# EAGLE design 18650 Capacity (EAGLE 7.5.0)
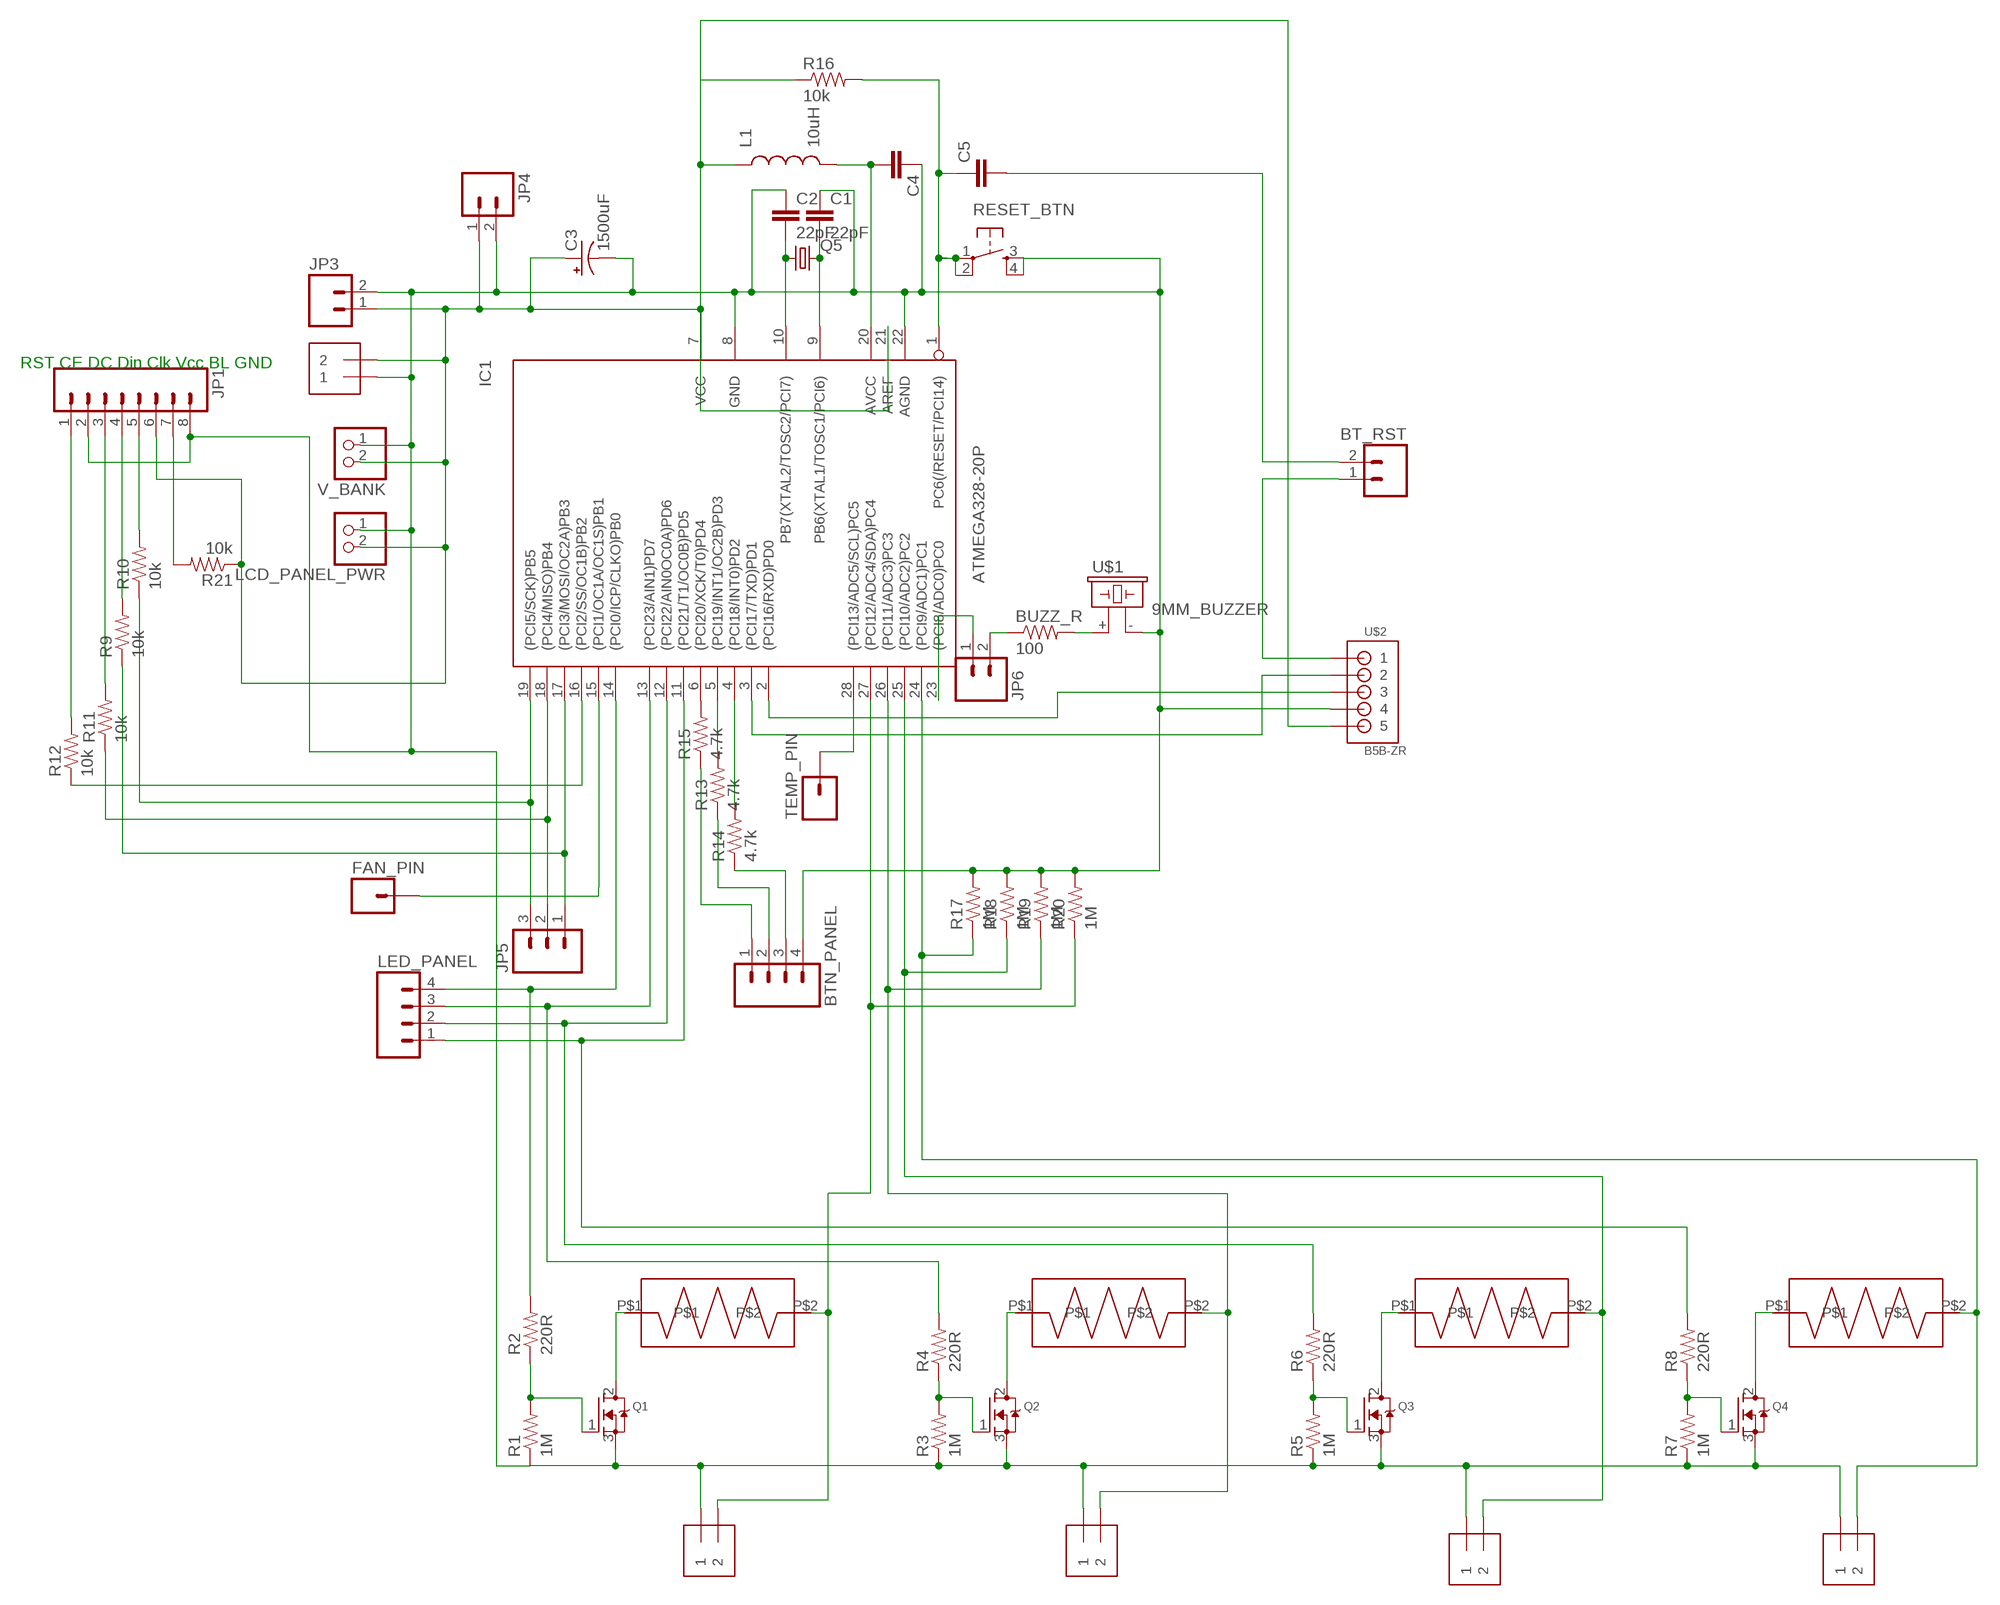
[diagram p0: schematic, sheet 1]

## Parts
5V_VIN  1X2-3.5MM  [1X2-3.5MM]
BATT1  1X2-3.5MM  [1X2-3.5MM]
BATT2  1X2-3.5MM  [1X2-3.5MM]
BATT3  1X2-3.5MM  [1X2-3.5MM]
BATT4  1X2-3.5MM  [1X2-3.5MM]
BT_RST  M02LOCK  [1X02_LOCK]
BTN_PANEL  M04LOCK  [1X04_LOCK]
BUZZ_R  100  RESISTOR1206  [1206]
C1  22pF  CAPEZ  [CAP-PTH-SMALLEZ]
C2  22pF  CAPEZ  [CAP-PTH-SMALLEZ]
C3  1500uF  CAP_POLPTH1  [CPOL-RADIAL-100UF-25V]
C4  CAPPTH1  [CAP-PTH-5MM]
C5  CAP_  [AXIAL-5MM]
FAN_PIN  M01PTH  [1X01]
IC1  ATMEGA328-20P  [DIL28-3]
JP1  M08LOCK  [1X08_LOCK]
JP3  M02LOCK  [1X02_LOCK]
JP4  M02LOCK  [1X02_LOCK]
JP5  M03PTH  [1X03]
JP6  M02LOCK  [1X02_LOCK]
L1  10uH  INDUCTORRLB0912  [RLB0912]
LCD_PANEL_PWR  JST_2PIN-THM  [JST-PH-2-THM]
LED_PANEL  M04LOCK  [1X04_LOCK]
LOAD4  CEMENT_RESISTOR  [CEMENT_RESISTOR]
LOAD_1  CEMENT_RESISTOR  [CEMENT_RESISTOR]
LOAD_2  CEMENT_RESISTOR  [CEMENT_RESISTOR]
Q1  MOSFET-NGDS_TO220V  [TO220V]
Q2  MOSFET-NGDS_TO220V  [TO220V]
Q3  MOSFET-NGDS_TO220V  [TO220V]
Q4  MOSFET-NGDS_TO220V  [TO220V]
Q5  CRYTALHC49S  [HC49/S]
R1  1M  RESISTORAXIAL-0.3  [AXIAL-0.3]
R2  220R  RESISTORAXIAL-0.3  [AXIAL-0.3]
R3  1M  RESISTORAXIAL-0.3  [AXIAL-0.3]
R4  220R  RESISTORAXIAL-0.3  [AXIAL-0.3]
R5  1M  RESISTORAXIAL-0.3  [AXIAL-0.3]
R6  220R  RESISTORAXIAL-0.3  [AXIAL-0.3]
R7  1M  RESISTORAXIAL-0.3  [AXIAL-0.3]
R8  220R  RESISTORAXIAL-0.3  [AXIAL-0.3]
R9  10k  RESISTORAXIAL-0.3  [AXIAL-0.3]
R10  10k  RESISTORAXIAL-0.3  [AXIAL-0.3]
R11  10k  RESISTORAXIAL-0.3  [AXIAL-0.3]
R12  10k  RESISTORAXIAL-0.3  [AXIAL-0.3]
R13  4.7k  RESISTORAXIAL-0.3  [AXIAL-0.3]
R14  4.7k  RESISTORAXIAL-0.3  [AXIAL-0.3]
R15  4.7k  RESISTORAXIAL-0.3  [AXIAL-0.3]
R16  10k  RESISTORAXIAL-0.3  [AXIAL-0.3]
R17  1M  RESISTOR0805-RES  [0805]
R18  1M  RESISTOR0805-RES  [0805]
R19  1M  RESISTOR0805-RES  [0805]
R20  1M  RESISTOR0805-RES  [0805]
R21  10k  RESISTOR1206  [1206]
RESET_BTN  TAC_SWITCHPTH  [TACTILE-PTH]
TEMP_PIN  M01PTH  [1X01]
U$1  9MM_BUZZER  [AL11P]
U$2  B5B-ZR  [B5B-ZR]
U$3  CEMENT_RESISTOR  [CEMENT_RESISTOR]
V_BANK  JST_2PIN-THM  [JST-PH-2-THM]

## Nets
BATT_V1: BATT1.2 IC1.27((PCI12/ADC4/SDA)PC4) LOAD_1.P$2 R20.1
BATT_V2: BATT2.2 IC1.26((PCI11/ADC3)PC3) LOAD_2.P$2 R19.1
BATT_V3: BATT3.2 IC1.25((PCI10/ADC2)PC2) R18.1 U$3.P$2
BATT_V4: BATT4.2 IC1.24((PCI9/ADC1)PC1) LOAD4.P$2 R17.1
BT_RX: IC1.3((PCI17/TXD)PD1) U$2.2
BT_STATE: BT_RST.2 C5.P$2
BT_TX: IC1.2((PCI16/RXD)PD0) U$2.3
CLK: JP1.5 R10.P$2
CLK1: IC1.19((PCI5/SCK)PB5) JP5.3 R10.P$1
DC: JP1.3 R11.P$2
DC1: IC1.18((PCI4/MISO)PB4) JP5.2 R11.P$1
DIN: JP1.4 R9.P$2
DIN1: IC1.17((PCI3/MOSI/OC2A)PB3) JP5.1 R9.P$1
GATE1: IC1.14((PCI0/ICP/CLKO)PB0) LED_PANEL.4 R2.P$2
GATE2: IC1.13((PCI23/AIN1)PD7) LED_PANEL.3 R4.P$2
GATE3: IC1.12((PCI22/AIN0OC0A)PD6) LED_PANEL.2 R6.P$2
GATE4: IC1.11((PCI21/T1/OC0B)PD5) LED_PANEL.1 R8.P$2
GND: 5V_VIN.1 BATT1.1 BATT2.1 BATT3.1 BATT4.1 BTN_PANEL.4 C1.1 C2.1 C3.2(-) C4.1 IC1.8(GND) IC1.22(AGND) JP1.2 JP1.8 JP3.2 JP4.2 LCD_PANEL_PWR.1 Q1.3(S) Q2.3(S) Q3.3(S) Q4.3(S) R1.P$1 R3.P$1 R5.P$1 R7.P$1 R17.2 R18.2 R19.2 R20.2 RESET_BTN.3 RESET_BTN.4 U$1.- U$2.4 V_BANK.1
N$1: C2.2 IC1.10(PB7(XTAL2/TOSC2/PCI7)) Q5.1
N$3: LOAD4.P$1 Q4.2(D)
N$4: BUZZ_R.1 JP6.2
N$5: IC1.4((PCI18/INT0)PD2) R14.P$2
N$6: Q1.1(G) R1.P$2 R2.P$1
N$7: Q2.1(G) R3.P$2 R4.P$1
N$8: Q3.1(G) R5.P$2 R6.P$1
N$9: Q4.1(G) R7.P$2 R8.P$1
N$10: C1.2 IC1.9(PB6(XTAL1/TOSC1/PCI6)) Q5.2
N$11: C5.P$1 IC1.1(PC6(/RESET/PCI14)) R16.P$2 RESET_BTN.1 RESET_BTN.2
N$12: IC1.5((PCI19/INT1/OC2B)PD3) R13.P$2
N$13: IC1.23((PCI8/ADC0)PC0) JP6.1
N$14: C4.2 IC1.20(AVCC) L1.2
N$16: IC1.6((PCI20/XCK/T0)PD4) R15.P$2
N$17: BTN_PANEL.2 R13.P$1
N$18: LOAD_1.P$1 Q1.2(D)
N$19: LOAD_2.P$1 Q2.2(D)
N$20: Q3.2(D) U$3.P$1
N$21: BTN_PANEL.3 R14.P$1
N$22: BTN_PANEL.1 R15.P$1
N$23: BT_RST.1 U$2.1
N$24: BUZZ_R.2 U$1.+
N$25: IC1.28((PCI13/ADC5/SCL)PC5) TEMP_PIN.1
PMW_LED: JP1.7 R21.2
PWM_LED1: FAN_PIN.1 IC1.15((PCI1/OC1A/OC1S)PB1)
RST: JP1.1 R12.P$2
RST1: IC1.16((PCI2/SS/OC1B)PB2) R12.P$1
VCC: 5V_VIN.2 C3.1(+) IC1.7(VCC) IC1.21(AREF) JP1.6 JP3.1 JP4.1 L1.1 LCD_PANEL_PWR.2 R16.P$1 R21.1 U$2.5 V_BANK.2

## Notes on the sheet
- RST CE DC Din Clk Vcc BL GND

## Library data of the parts
5V_VIN BATT1-BATT4 = adafruit:1X2: 3.5mm Terminal block http://www.ladyada.net/library/pcb/eaglelibrary.html
BT_RST JP3 JP4 JP6 = SparkFun-Connectors:M02: Standard 2-pin 0.1" header. Use with - straight break away headers ( PRT-00116) - right angle break away headers (PRT-00553) - swiss pins (PRT-00743) - machine pins (PRT-00117) - female headers (PRT-00115) Molex polarized connector foot print use with: PRT-08233 with associated crimp pins and housings. 2.54_SCREWTERM for use with PRT-10571. 3.5mm Screw Terminal footprints for PRT-08084 5mm Screw Terminal footprints for use with PRT-08432
BTN_PANEL LED_PANEL = SparkFun-Connectors:M04: Header 4 Standard 4-pin 0.1" header. Use with straight break away headers (SKU : PRT-00116), right angle break away headers (PRT-00553), swiss pins (PRT-00743), machine pins (PRT-00117), and female headers (PRT-00115). Molex polarized connector foot print use with SKU : PRT-08231 with associated crimp pins and housings. 1MM SMD Version SKU: PRT-10208
BUZZ_R R9-R16 = SparkFun-Resistors:RESISTOR: Resistor Basic schematic elements and footprints for 0603, 1206, and PTH resistors.
C1 C2 C4 C5 = SparkFun-Passives:CAP: Capacitor Standard 0603 ceramic capacitor, and 0.1" leaded capacitor.
C3 = SparkFun-Passives:CAP_POL: Capacitor Polarized These are standard SMD and PTH capacitors. Normally 10uF, 47uF, and 100uF in electrolytic and tantalum varieties. Always verify the external diameter of the through hole cap, it varies with capacity, voltage, and manufacturer. The EIA devices should be standard.
FAN_PIN TEMP_PIN = SparkFun-Connectors:M01: Header 1 Standard 1-pin 0.1" header. Use with straight break away headers (SKU : PRT-00116), right angle break away headers (PRT-00553), swiss pins (PRT-00743), machine pins (PRT-00117), and female headers (PRT-00115).
IC1 = atmega328:ATMEGA328*P: MICROCONTROLLER 32 kBytes FLASH 2 kBytes SRAM 1 kBytes EEPROM USART 8-channel 10 bit ADC
JP1 = SparkFun-Connectors:M08: Header 8 Standard 8-pin 0.1" header. Use with straight break away headers (SKU : PRT-00116), right angle break away headers (PRT-00553), swiss pins (PRT-00743), machine pins (PRT-00117), and female headers (PRT-00115).
JP5 = SparkFun-Connectors:M03: Header 3 Standard 3-pin 0.1" header. Use with straight break away headers (SKU : PRT-00116), right angle break away headers (PRT-00553), swiss pins (PRT-00743), machine pins (PRT-00117), and female headers (PRT-00115). Molex polarized connector foot print use with SKU : PRT-08232 with associated crimp pins and housings.
L1 = SparkFun-Passives:INDUCTOR: Inductors Basic Inductor/Choke - 0603 and 1206. Footprints are not proven and vary greatly between part numbers. INDUCTOR POWER 3.3UH 4.0A SMD 0.197" L x 0.197" W x 0.177" H (5.00mm x 5.00mm x 4.50mm)
LCD_PANEL_PWR V_BANK = adafruit:JST_2PIN: JST 2-Pin Connectors of various flavors SMT-RA (S2B-PH-SM4) 4UConnector #17311 SMT (B2B-PH-SM4) THM-RA (S2B-PH) THM (B2B-PH)
LOAD4 LOAD_1 LOAD_2 U$3 = Jon_SelfMade:CEMENT_RESISTOR
Q1-Q4 = adafruit:MOSFET-N: N-Channel Mosfet 2N7002E - 60V 260mA SOT23 [Digikey: 2N7002ET1GOSTR-ND] - REEL BSH103 - 30V 850mA SOT23 [Digikey: 568-5013-1-ND]
Q5 = Crystals:CRYTAL: CRYSTAL
R1-R8 R17-R21 = SparkFun-Passives:RESISTOR: Resistor Basic schematic elements and footprints for 0603, 1206, and PTH resistors.
RESET_BTN = SparkFun-Retired:TAC_SWITCH: Momentary Switch Button commonly used for reset or general input. Spark Fun Electronics SKU : COM-00097 SMT- SWCH-08247
U$1 = Jon_SelfMade:9MM_BUZZER
U$2 = jst:B5B-ZR: JST-ZH Connector 5 pol, 1.5mm pitch Package: B5B-ZR Source: http://www.jst-mfg.com/product/pdf/eng/eZH.pdf

## Board
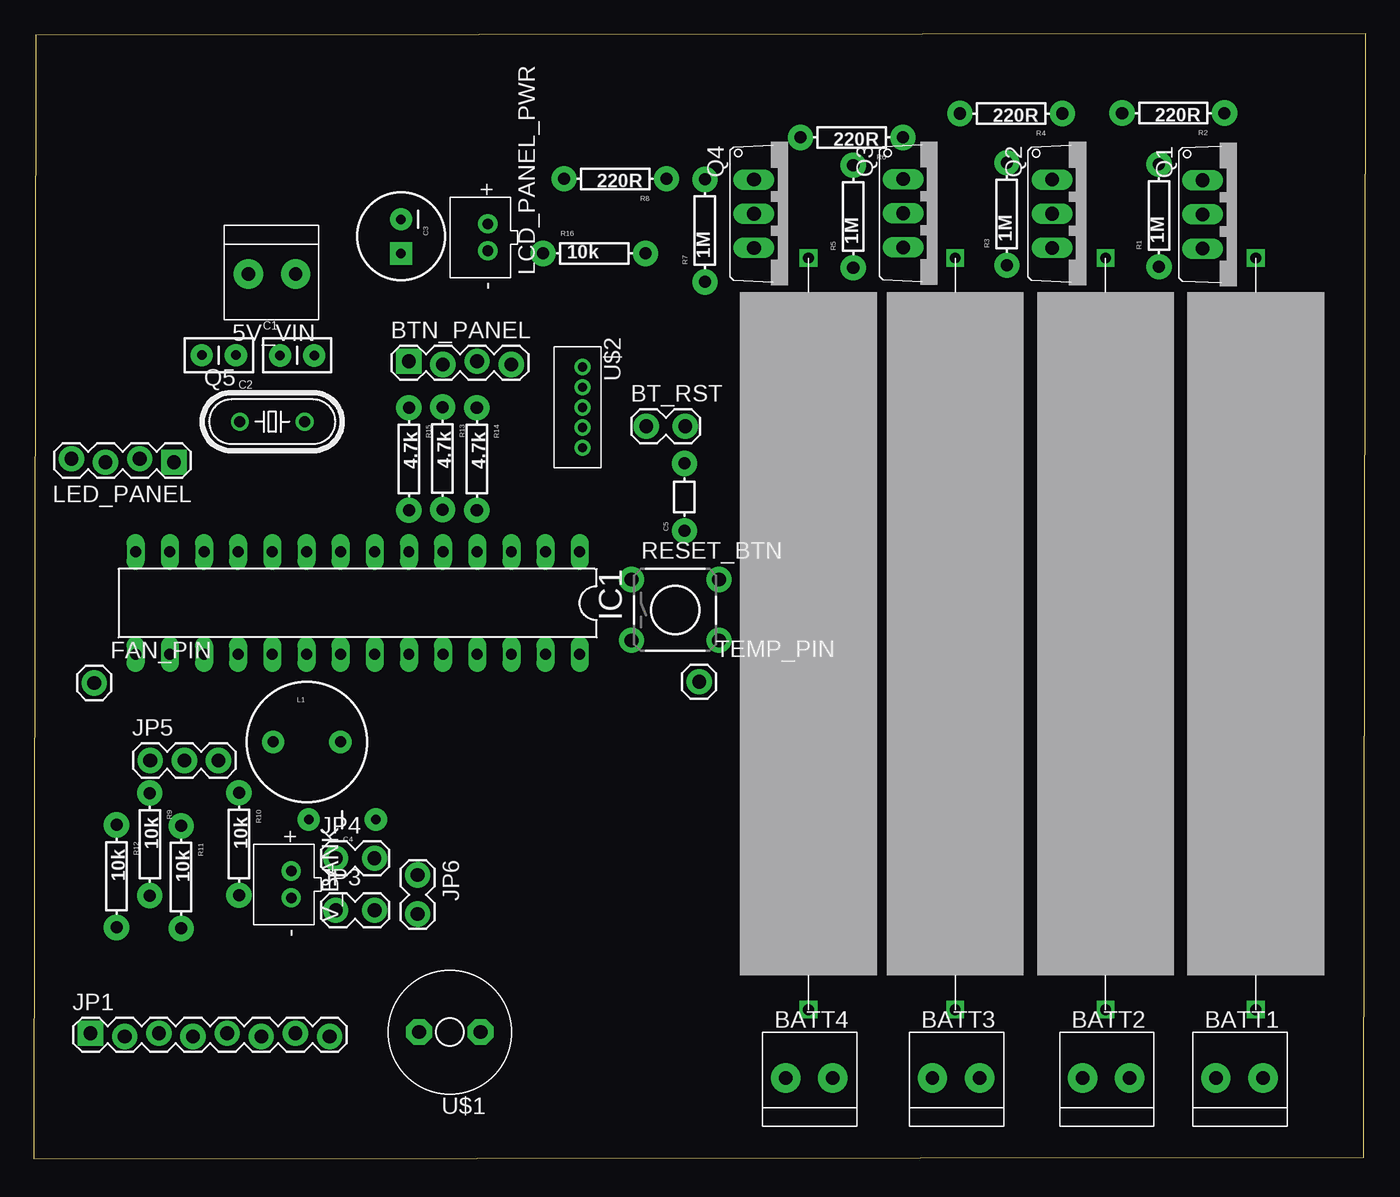
[diagram p1: board, top side]
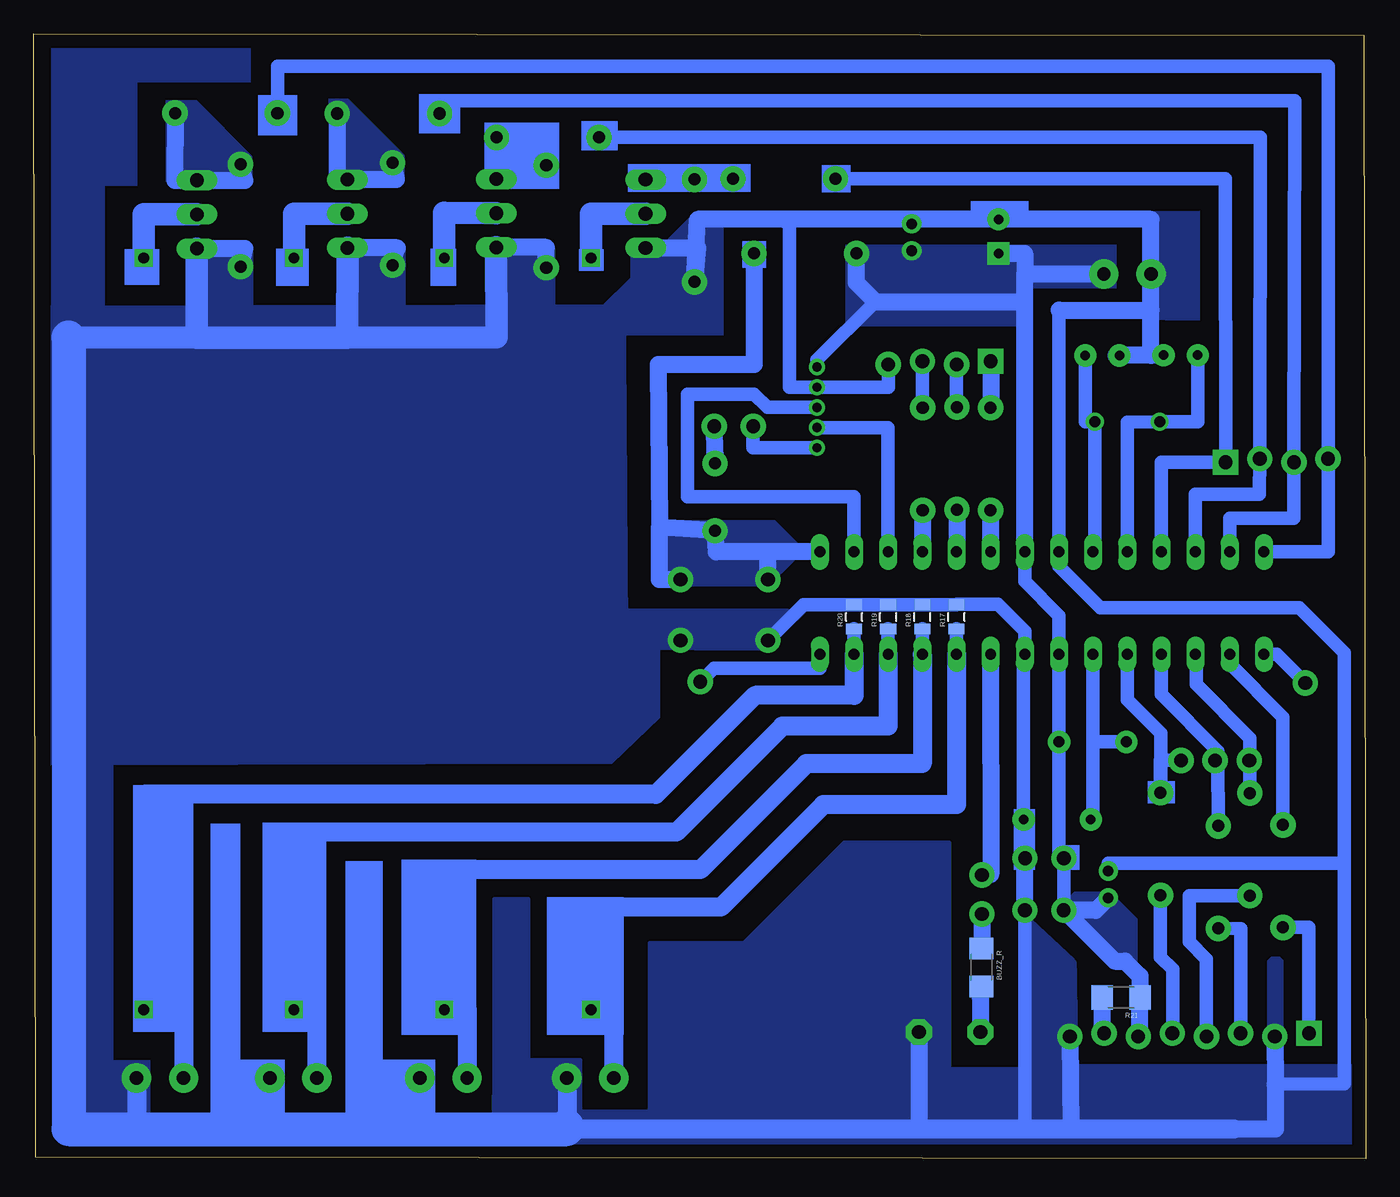
[diagram p2: board, bottom side, seen from below]

Size 99.09 x 83.66 mm. Coordinates in mm from the lower left corner, seen from the top.
Outline: 0,0 98.94,0.11 99.09,83.66 0.16,83.55 0,0
Copper layers (1*16): Top 0.035mm / dielectric 1.5mm / Bottom 0.035mm
Design rules "default": minimum track width 10mil, minimum drill 24mil, track to track 8mil, track to pad 8mil, pad to pad 8mil, via to via 8mil, smd to smd 8mil, copper to edge 40mil, drill to drill 8mil, minimum pad ring 10mil, minimum via ring 8mil, stop-mask expansion 4mil, vias tented up to drill 0mil, thermal gap 10mil

### Footprints (pad centres in the part's own frame; a part is rotated, then mirrored left to right if it is on the bottom)
1X2-3.5MM = drill 1 pad 2.184: 1 1.8,0; 2 -1.7,0
1X02_LOCK = drill 1.016 pad 1.88: 1 -0.178,0; 2 2.718,0
1X04_LOCK = drill 1.016 pad 1.88 square: 1 0,0.127 | drill 1.016 pad 1.88: 2 2.54,-0.127; 3 5.08,0.127; 4 7.62,-0.127
1206 = smd 1.6 x 1.8: 1 -1.4,0; 2 1.4,0
CAP-PTH-SMALLEZ = drill 0.7 pad 1.651: 1 0,0; 2 2.54,0
CPOL-RADIAL-100UF-25V = drill 0.7 pad 1.651 square: 1 1.27,0 | drill 0.7 pad 1.651: 2 -1.27,0
CAP-PTH-5MM = drill 0.7 pad 1.651: 1 -2.5,0; 2 2.5,0
AXIAL-5MM = drill 0.9 pad 1.88: P$1 -2.5,0; P$2 2.5,0
1X01 = drill 1.016 pad 1.88: 1 0,0
DIL28-3 = drill 0.813 long: 1 -16.51,-3.81; 2 -13.97,-3.81; 3 -11.43,-3.81; 4 -8.89,-3.81; 5 -6.35,-3.81; 6 -3.81,-3.81; 7 -1.27,-3.81; 8 1.27,-3.81; 9 3.81,-3.81; 10 6.35,-3.81; 11 8.89,-3.81; 12 11.43,-3.81; 13 13.97,-3.81; 14 16.51,-3.81; 15 16.51,3.81; 16 13.97,3.81; 17 11.43,3.81; 18 8.89,3.81; 19 6.35,3.81; 20 3.81,3.81; 21 1.27,3.81; 22 -1.27,3.81; 23 -3.81,3.81; 24 -6.35,3.81; 25 -8.89,3.81; 26 -11.43,3.81; 27 -13.97,3.81; 28 -16.51,3.81
1X08_LOCK = drill 1.016 pad 1.88 square: 1 0,0.127 | drill 1.016 pad 1.88: 2 2.54,-0.127; 3 5.08,0.127; 4 7.62,-0.127; 5 10.16,0.127; 6 12.7,-0.127; 7 15.24,0.127; 8 17.78,-0.127
1X03 = drill 1.016 pad 1.88: 1 0,0; 2 2.54,0; 3 5.08,0
RLB0912 = drill 0.813 pad 1.651: 1 2.502,0; 2 -2.502,0
JST-PH-2-THM = drill 0.8 pad 1.422: 1 1,0; 2 -1,0
CEMENT_RESISTOR = drill 0.8 square: P$1 -27.94,0; P$2 27.94,0
TO220V = drill 1.016 long: 1 -2.54,-2.54; 2 0,-2.54; 3 2.54,-2.54
HC49/S = drill 0.813: 1 -2.413,0; 2 2.413,0
AXIAL-0.3 = drill 0.9 pad 1.88: P$1 -3.81,0; P$2 3.81,0
0805 = smd 0.8 x 1.2: 1 -0.9,0; 2 0.9,0
TACTILE-PTH = drill 1.016 pad 1.88: 1 -3.251,2.261; 2 3.251,2.261; 3 -3.251,-2.261; 4 3.251,-2.261
AL11P = drill 1.016 pad 1.905 octagon: + 2.286,0; - -2.286,0
B5B-ZR = drill 0.7: 1 7.5,-1.3; 2 6,-1.3; 3 4.5,-1.3; 4 3,-1.3; 5 1.5,-1.3

### Placement (x,y rotation side)
5V_VIN  17.79,65.8 180 top
BATT1  89.63,6.01 0 top
BATT2  79.73,6.01 0 top
BATT3  68.55,6.01 0 top
BATT4  57.63,6.01 0 top
BT_RST  45.75,54.47 0 top
BTN_PANEL  27.91,59.18 0 top
BUZZ_R  28.6,14.23 270 bottom
C1  18.33,59.74 0 top
C2  15.05,59.76 180 top
C3  27.32,68.58 270 top
C4  22.96,25.22 180 top
C5  48.41,49.21 90 top
FAN_PIN  4.51,35.38 0 top
IC1  24.1,41.32 180 top
JP1  4.23,9.21 0 top
JP3  22.65,18.48 0 top
JP4  22.64,22.35 0 top
JP5  8.67,29.62 0 top
JP6  28.56,20.92 270 top
L1  20.32,31 0 top
LCD_PANEL_PWR  33.79,68.51 90 top
LED_PANEL  10.43,51.92 180 top
LOAD4  57.63,39.03 270 top
LOAD_1  90.9,39.03 270 top
LOAD_2  79.73,39.03 270 top
Q1  89.5,70.22 270 top
Q2  78.29,70.27 270 top
Q3  67.22,70.31 270 top
Q4  56.12,70.27 270 top
Q5  17.75,54.81 0 top
R1  83.7,70.13 90 top
R2  84.77,77.76 180 top
R3  72.39,70.25 90 top
R4  72.71,77.72 180 top
R5  60.96,70.06 90 top
R6  60.85,75.95 180 top
R7  49.94,69.01 90 top
R8  43.26,72.86 180 top
R9  8.64,23.38 270 top
R10  15.28,23.4 270 top
R11  10.97,20.94 270 top
R12  6.17,21.02 270 top
R13  30.41,52.08 270 top
R14  32.97,52.03 270 top
R15  27.92,52.04 270 top
R16  41.71,67.32 0 top
R17  30.45,40.3 90 bottom
R18  32.99,40.3 90 bottom
R19  35.53,40.3 90 bottom
R20  38.07,40.3 90 bottom
R21  18.21,12 180 bottom
RESET_BTN  47.72,40.81 0 top
TEMP_PIN  49.5,35.48 0 top
U$1  30.96,9.42 180 top
U$2  42.13,60.37 270 top
U$3  68.55,39.03 270 top
V_BANK  19.17,20.4 90 top

### Tracks (layer width: path | path; a pad name or v marks a point on that pad's centre or on a via)
BATT_V1
  Bottom 1.016: R20.1 IC1.27
  Bottom 1.422: BATT1.2 87.93,11.09 LOAD_1.P$2 90.9,27.09 52.8,27.09 45.44,34.46 38.07,34.46 IC1.27
BATT_V2
  Bottom 1.016: R19.1 IC1.26
  Bottom 1.422: BATT2.2 78.03,11.09 LOAD_2.P$2 79.73,24.3 51.28,24.3 43.41,32.17 35.53,32.17 IC1.26
BATT_V3
  Bottom 1.016: R18.1 IC1.25
  Bottom 1.422: BATT3.2 66.85,11.09 U$3.P$2 68.55,21.51 49.5,21.51 41.63,29.38 32.99,29.38 IC1.25
BATT_V4
  Bottom 1.016: R17.1 IC1.24
  Bottom 1.422: BATT4.2 55.93,11.09 LOAD4.P$2 57.63,18.71 47.98,18.71 40.36,26.33 30.45,26.33 IC1.24
BT_RX
  Bottom 1.016: U$2.2 35.53,54.37 IC1.3
BT_STATE
  Bottom 1.27: C5.P$2 48.4,52.42 BT_RST.2
BT_TX
  Bottom 1.016: U$2.3 44.51,55.87 45.5,56.86 50.45,56.86 50.45,49.22 38.07,49.22 IC1.2
CLK
  Bottom 1.016: R10.P$2 15.29,15 14.38,14.09 14.37,9.37 JP1.5
CLK1
  Bottom 1.016: IC1.19 17.75,34.12 15.27,31.63 15.27,27.22 R10.P$1 15.28,29.62 JP5.3
DC
  Bottom 1.016: R11.P$2 9.31,17.12 JP1.3
DC1
  Bottom 0.61: JP5.2 11.16,29.62 11,29.78
  Bottom 1.016: R11.P$1 11,29.78 11,30.31 15.22,34.53 IC1.18
DIN
  Bottom 1.016: R9.P$2 13.13,19.55 13.12,16.12 11.85,14.86 JP1.4
DIN1
  Bottom 0.61: JP5.1 8.67,30.7 8.62,30.74
  Bottom 1.016: R9.P$1 8.62,30.74 8.62,31.29 12.62,35.28 12.62,37.45 IC1.17
GATE1
  Bottom 1.016: IC1.14 2.8,45.13 LED_PANEL.4 2.81,81.22 80.96,81.22 R2.P$2
GATE2
  Bottom 1.016: IC1.13 10.13,47.62 5.35,47.62 LED_PANEL.3 5.3,78.67 68.9,78.67 R4.P$2
GATE3
  Bottom 1.016: IC1.12 12.67,49.41 7.94,49.4 LED_PANEL.2 7.87,75.94 52.92,75.94 R6.P$2
GATE4
  Bottom 1.016: IC1.11 15.22,51.79 LED_PANEL.1 10.44,72.88 R8.P$2
GND
  Bottom 1.016: 25.37,25.17 25.37,2.2 27.67,2.2 | BTN_PANEL.4 arc-90 BTN_PANEL.4 35.53,57.37 U$2.4 42.87,57.37 42.87,69.71 | RESET_BTN.3 41.82,41.2 R20.2 R19.2 R18.2 R17.2 30.43,41.22 27.37,41.22 25.37,39.23 IC1.22 25.46,37.42 C4.1 25.36,25.12 JP4.2 | 22.83,44.08 19.74,40.98 4.95,40.98 1.6,37.63 1.6,21.97 | 6.75,5.54 1.6,5.57 1.6,21.97 | IC1.8 22.83,63.1 | V_BANK.1 19.17,21.97 1.6,21.97 | LCD_PANEL_PWR.1 33.45,69.85 C3.2
  Bottom 1.27: U$1.- 33.25,2.2 | JP1.8 21.96,2.2 | JP1.2 6.75,5.54 6.72,2.2 9.82,2.2 | 15.99,59.74 18.58,59.74 C1.1 | C2.1 15.99,59.74 | 15.99,59.74 15.99,63.1 | 15.99,63.1 5V_VIN.1 15.99,69.85 C3.2 43.31,69.85 | 43.31,69.85 49.7,69.85 R7.P$1 49.7,67.73 Q4.3 | 22.83,63.1 15.99,63.1 | R5.P$1 60.96,67.77 Q3.3 | R3.P$1 72.05,67.73 Q2.3 | R1.P$1 83.38,67.68 Q1.3 | 42.87,69.71 43.31,69.85 | JP3.2 JP4.2
  Bottom 1.422: BATT3.1 70.35,2.2 | BATT1.1 91.43,2.2 | BATT2.1 81.53,2.2 | BATT4.1 59.43,2.46 | 9.82,2.2 21.96,2.2 27.67,2.2 33.25,2.2 59.43,2.2
  Bottom 1.676: Q1.3 86.95,61.05 | 86.95,61.05 96.49,61.07 | Q2.3 75.76,61.06 | 75.76,61.06 86.95,61.05 | Q3.3 64.66,61.07 75.76,61.06
  Bottom 2.54: 96.49,61.07 96.49,2.2 91.43,2.2 81.53,2.2 70.35,2.2 59.43,2.2 59.43,2.46
  pour Bottom (no thermals): 30.96,23.54 30.97,6.71 25.62,6.71 25.67,2.31 64.87,2.18 64.85,7.38 64.85,19.33 62.27,19.33 62.27,7.38 58.42,7.38 58.42,3.53 53.3,3.56 53.27,16.08 46.3,16.07 38.83,23.54
  pour Bottom: 97.82,29.28 56.07,29.38 52.52,32.81 52.52,38.34 54.89,38.33 54.89,39.11 55.04,60.18 55.04,61.25 52.7,63.55 97.81,63.44
  pour Bottom (no thermals): 93.72,30.03 95.82,30.03 95.82,1.88 90.42,1.88 90.42,7.33 93.17,7.33 93.17,29.73
  pour Bottom (no thermals): 42.97,40.88 55.22,40.88 55.29,37.86 44.57,37.78 41.57,40.72
  pour Bottom (no thermals): 22.02,14.5 25.22,17.48 25.22,2.43 22.07,2.43 22.07,5.03 21.92,5.98 21.97,13.78
  pour Bottom (no thermals): 6.12,5.03 6.14,14.78 6.39,15.03 7.04,15.03 7.34,14.73 7.32,4.08 7.02,4.08
  pour Bottom: 0.87,7.03 25.32,7.03 25.32,2.93 59.77,2.93 59.77,1.05 0.87,1.08
  pour Bottom (no thermals): 54.7,63.37 54.7,68.16 49.46,68.16 49.46,66.5 53.09,62.87
  pour Bottom (no thermals): 64.59,63.18 64.59,67.74 60.33,67.74 60.33,62.98 61.43,62.98
  pour Bottom (no thermals): 75.51,62.75 75.51,67.58 71.42,67.58 71.42,63.12 72.49,63.12
  pour Bottom (no thermals): 86.9,63 86.9,67.46 82.75,67.46 82.75,62.51 85.01,62.51
  pour Bottom (no thermals): 47.79,69.29 47.79,61.24 58.79,61.24 58.79,61.44 52.81,67.42 52.81,67.51 50.03,70.29
  pour Bottom (no thermals): 97.8,63.21 97.8,82.93 82.97,82.93 82.97,80.04 91.39,80.04 91.39,72.34 93.81,72.33 93.82,61.93 94.99,61.93
  pour Bottom (no thermals): 15.7,62.4 16.11,70.46 12.37,70.49 12.37,62.33 14.91,62.33
N$1
  Bottom 1.016: IC1.10 17.75,54.78 Q5.1 12.51,54.8 C2.2
N$3
  Bottom 1.676: LOAD4.P$1 57.63,70.27 Q4.2
N$4
  Bottom 1.27: JP6.2 28.56,15.67 BUZZ_R.1
N$5
  Bottom 1.27: R14.P$2 32.97,45.13 IC1.4
N$6
  Bottom 1.27: R1.P$2 83.38,72.76 Q1.1 88.59,72.76 R2.P$1
  pour Bottom (no thermals): 82.83,74.34 82.83,74.56 86.98,78.71 89.26,78.71 89.26,72.67 83.35,72.67 82.8,72.7
N$7
  Bottom 1.27: R3.P$2 72.12,72.81 Q2.1 76.52,72.81 R4.P$1
  pour Bottom (no thermals): 71.51,72.9 71.51,74.6 75.71,78.8 77.14,78.8 77.14,72.81
N$8
  Bottom 1.422: Q3.1 64.65,73.87 | R6.P$1 64.66,73.87 64.65,73.87 | 64.65,73.87 R5.P$2
N$9
  Bottom 1.27: R8.P$1 47.07,72.82 R7.P$2 Q4.1
N$10
  Bottom 1.016: IC1.9 20.16,44.62 Q5.2 20.87,54.8 C1.2
N$11
  Bottom 1.27: IC1.1 44.47,45.13 | 52.55,46.95 C5.P$1 48.32,45.13 44.47,45.13 | RESET_BTN.2 52.55,43.07 52.55,46.95 | RESET_BTN.1 44.47,45.13 | 52.55,46.95 52.64,59.05 45.51,59.04 R16.P$2
  pour Bottom (no thermals): 51.67,42.58 44.42,42.58 42.52,44.48 42.07,45.58 43.97,47.48 52.52,47.48 52.87,45.63
N$12
  Bottom 1.27: R13.P$2 30.41,45.13 IC1.5
N$13
  Bottom 1.27: IC1.23 27.89,21.14 28.51,21.14 JP6.1
N$14
  Bottom 1.016: C4.2 20.29,25.22 20.29,31 | 20.29,31 IC1.20 | L1.2 20.29,31
N$16
  Bottom 1.27: R15.P$2 IC1.6
N$17
  Bottom 1.016: R13.P$1 arc90 30.45,55.92 BTN_PANEL.2
N$18
  Bottom 1.676: Q1.2 90.9,70.25 LOAD_1.P$1
N$19
  Bottom 1.676: Q2.2 79.73,70.27 LOAD_2.P$1
N$20
  Bottom 1.676: Q3.2 68.55,70.34 U$3.P$1
N$21
  Bottom 1.016: BTN_PANEL.3 arc90 32.97,59.29 R14.P$1
N$22
  Bottom 1.27: BTN_PANEL.1 27.91,55.85 R15.P$1
N$23
  Bottom 1.016: U$2.1 45.57,52.87 BT_RST.1
N$24
  Bottom 1.27: BUZZ_R.2 28.67,11.98 U$1.+
N$25
  Bottom 1.016: IC1.28 40.61,36.49 48.49,36.49 TEMP_PIN.1
PMW_LED
  Bottom 1.27: JP1.7 19.61,9.48 R21.2
PWM_LED1
  Bottom 1.016: FAN_PIN.1 6.63,37.51 IC1.15
RST
  Bottom 1.016: R12.P$2 4.26,17.22 JP1.1
RST1
  Bottom 1.016: IC1.16 10.13,36.8 6.17,32.83 6.17,31.11 R12.P$1
VCC
  Bottom 1.016: IC1.7 25.37,42.93 22.83,40.4 IC1.21 22.82,37.5 L1.1 22.82,22.35 JP4.1 22.47,22.35 JP3.1 | U$2.5 40.83,59.4 36.49,63.74
  Bottom 1.27: IC1.7 25.37,63.74 | 25.37,63.74 25.37,65.8 | 25.37,65.8 5V_VIN.2 | C3.1 25.37,67.31 25.37,65.8 | 25.37,63.74 36.49,63.74 37.9,65.15 R16.P$1 | JP1.6 16.81,9.21 R21.1 16.81,13.59 17.92,14.7 18.69,14.7 JP3.1 20.09,18.48 V_BANK.2
  pour Bottom (no thermals): 25.45,67.95 38.71,67.95 38.71,61.92 25.08,61.92 25.08,63.1
  pour Bottom (no thermals): 26.47,65.55 26.47,67.95 18.56,67.95 18.56,64.72 25.88,64.72
  pour Bottom (no thermals): 21.88,18.19 21.88,18.06 18.29,14.47 17.17,14.47 17.12,14.52 17.12,17.82 19.05,19.75 21.64,19.75 22.63,18.76
(copper drawn outside any net)
  shapes: Bottom area x23